# Altium schematic sheet Docking_Connection.SchDoc
size B; SheetNumber: 3; SheetTotal: 10
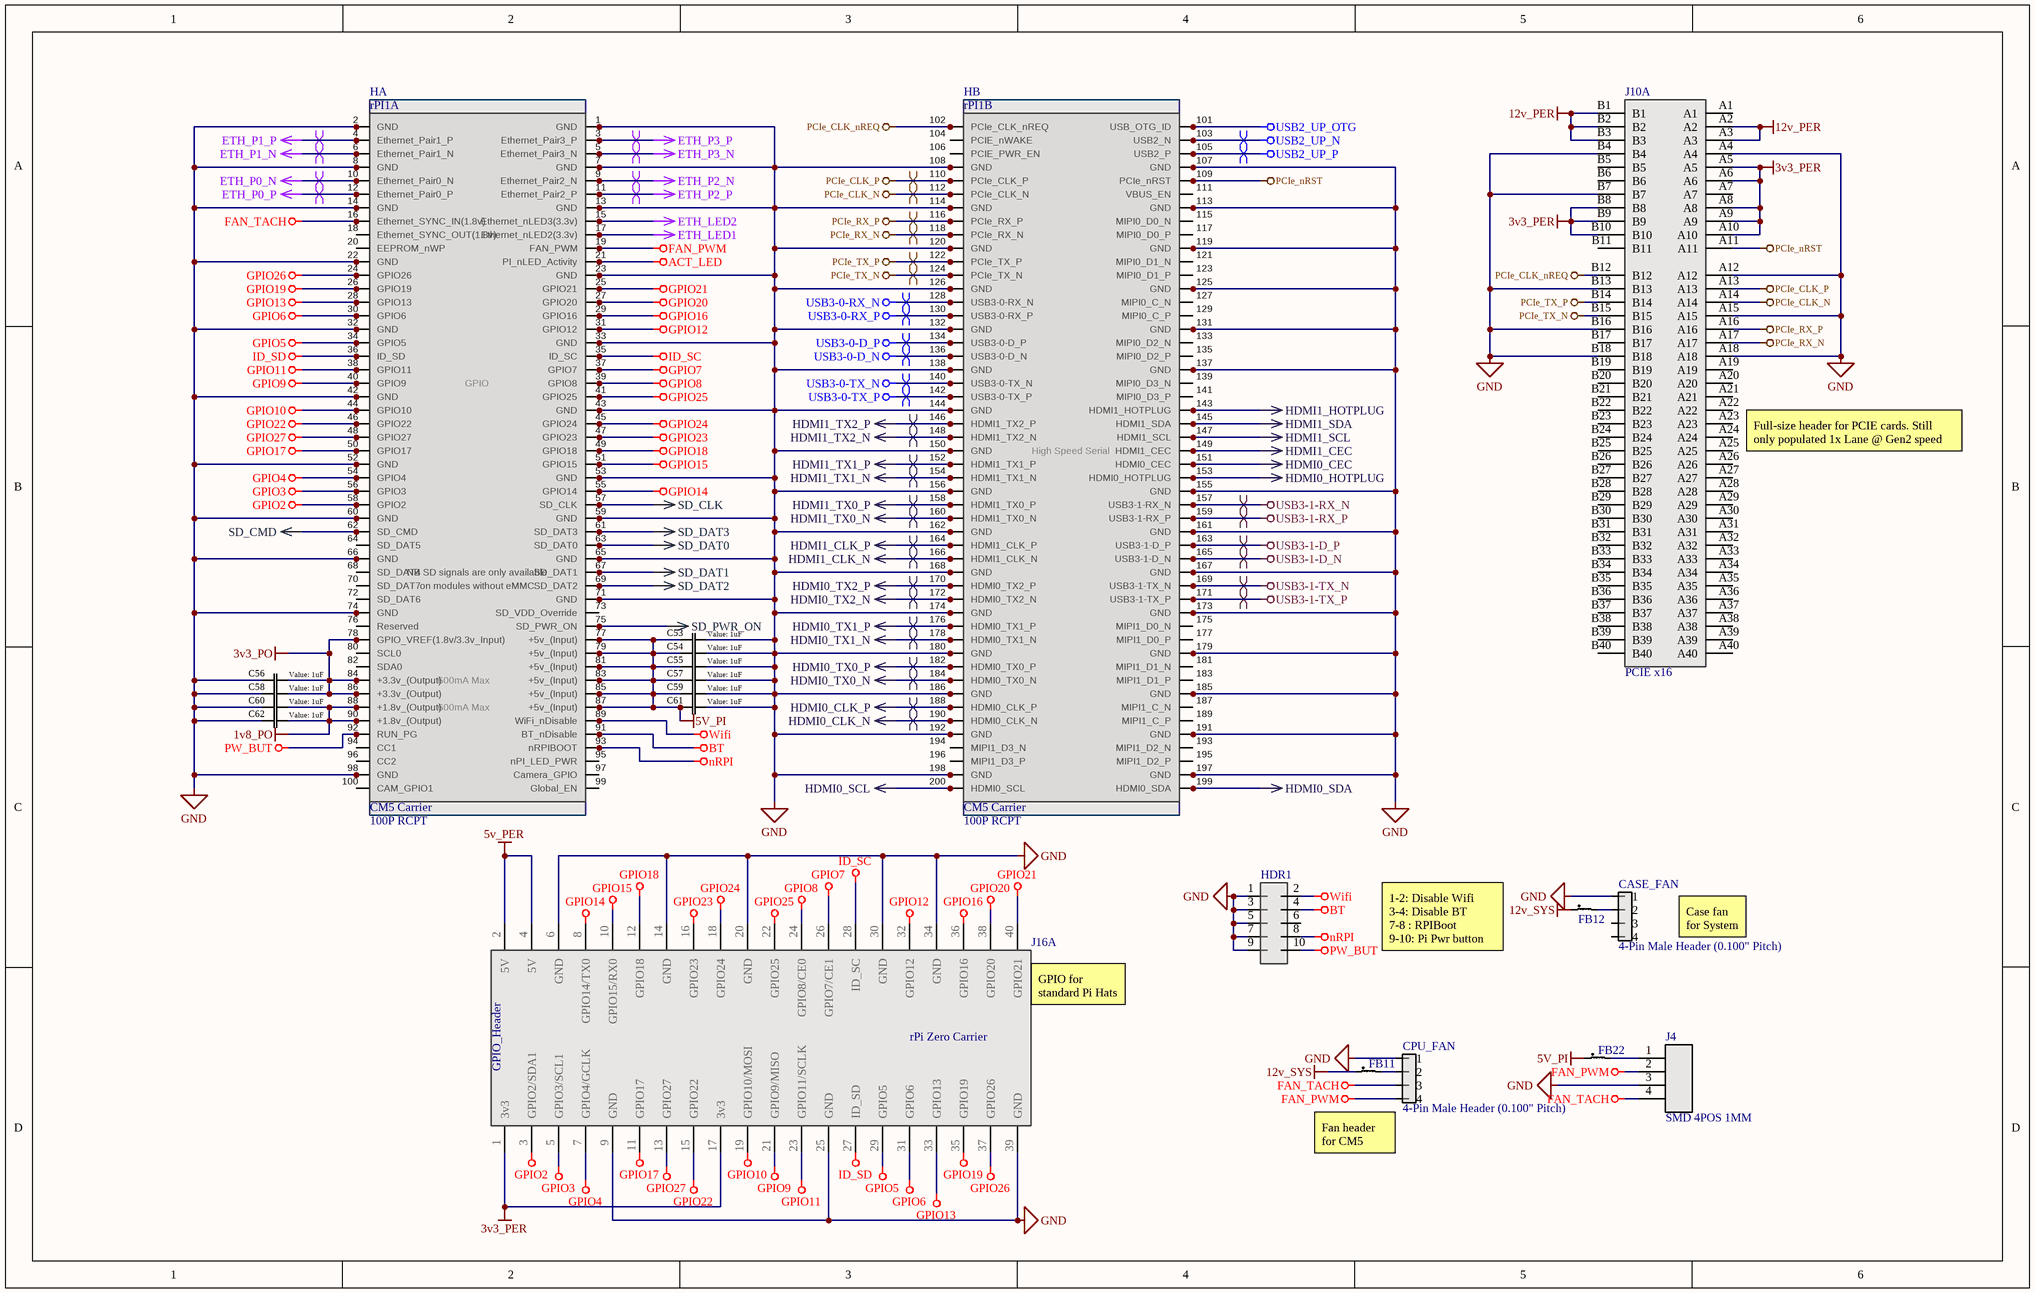
[diagram p0: Docking_Connection.SchDoc]

## Parts
C53  value 1uF  [0603]  (hidden comment: Generic Capacitor)
C54  value 1uF  [0603]  (hidden comment: Generic Capacitor)
C55  value 1uF  [0603]  (hidden comment: Generic Capacitor)
C56  value 1uF  [0603]  (hidden comment: Generic Capacitor)
C57  value 1uF  [0603]  (hidden comment: Generic Capacitor)
C58  value 1uF  [0603]  (hidden comment: Generic Capacitor)
C59  value 1uF  [0603]  (hidden comment: Generic Capacitor)
C60  value 1uF  [0603]  (hidden comment: Generic Capacitor)
C61  value 1uF  [0603]  (hidden comment: Generic Capacitor)
C62  value 1uF  [0603]  (hidden comment: Generic Capacitor)
CASE_FAN  4-Pin Male Header (0.100" Pitch)  [TSW-104-07-T-S]
CPU_FAN  4-Pin Male Header (0.100" Pitch)  [TSW-104-07-T-S]
FB11  0603 Ferrite  [0603]  (value not drawn)
FB12  0603 Ferrite  [0603]  (value not drawn)
FB22  0603 Ferrite  [0603]  (value not drawn)
HA  100P RCPT  [DF40HC(3.0)-100DS-0.4V(51)]
HB  100P RCPT  [DF40HC(3.0)-100DS-0.4V(51)]
HDR1  10pinMobo  [10pinMobo]  (value not drawn)
J4  SMD 4POS 1MM  [CONN4_BM04B-SRSS_JST]
J10  PCIE x16  [10018783-10203TLF]  (part A of 2)
J16  rPi Zero Carrier  [rPiZero]  (part A of 2)
rPI1  CM5 Carrier  [CM4-FTPD]  (parts A,B of 2)

## Nets
1v8_PO: C60.1 C62.1 HA.88 HA.90 rPI1.88(+1.8v_(Output)) rPI1.90(+1.8v_(Output))
3v3_PER: J10.A5 J10.A6 J10.A8 J10.A9 J10.A10 J10.B8 J10.B9 J10.B10 J16.1(3v3) J16.17(3v3)
3v3_PO: C56.1 C58.1 HA.78 HA.84 HA.86 rPI1.78(GPIO_VREF(1.8v/3.3v_Input)) rPI1.84(+3.3v_(Output)) rPI1.86(+3.3v_(Output))
5v_PER: J16.2(5V) J16.4(5V)
5V_PI: C53.2 C54.2 C55.2 C57.2 C59.2 C61.2 FB22.1 HA.77 HA.79 HA.81 HA.83 HA.85 HA.87 rPI1.77(+5v_(Input)) rPI1.79(+5v_(Input)) rPI1.81(+5v_(Input)) rPI1.83(+5v_(Input)) rPI1.85(+5v_(Input)) rPI1.87(+5v_(Input))
12v_PER: J10.A2 J10.A3 J10.B1 J10.B2 J10.B3
12v_SYS: FB11.1 FB12.1
ACT_LED: HA.21 rPI1.21(PI_nLED_Activity)
BT: HA.91 HDR1.4 rPI1.91(BT_nDisable)
ETH_LED1: HA.17 rPI1.17(Ethernet_nLED2(3.3v))
ETH_LED2: HA.15 rPI1.15(Ethernet_nLED3(3.3v))
ETH_P0_N: HA.10 rPI1.10(Ethernet_Pair0_N)
ETH_P0_P: HA.12 rPI1.12(Ethernet_Pair0_P)
ETH_P1_N: HA.6 rPI1.6(Ethernet_Pair1_N)
ETH_P1_P: HA.4 rPI1.4(Ethernet_Pair1_P)
ETH_P2_N: HA.9 rPI1.9(Ethernet_Pair2_N)
ETH_P2_P: HA.11 rPI1.11(Ethernet_Pair2_P)
ETH_P3_N: HA.5 rPI1.5(Ethernet_Pair3_N)
ETH_P3_P: HA.3 rPI1.3(Ethernet_Pair3_P)
FAN_PWM: CPU_FAN.4 HA.19 J4.2 rPI1.19(FAN_PWM)
FAN_TACH: CPU_FAN.3 HA.16 J4.4 rPI1.16(Ethernet_SYNC_IN(1.8v))
GND: C53.1 C54.1 C55.1 C56.2 C57.1 C58.2 C59.1 C60.2 C61.1 C62.2 CASE_FAN.1 CPU_FAN.1 HA.1 HA.2 HA.7 HA.8 HA.13 HA.14 HA.22 HA.23 HA.32 HA.33 HA.42 HA.43 HA.52 HA.53 HA.59 HA.60 HA.65 HA.66 HA.71 HA.74 HA.98 HB.7 HB.8 HB.13 HB.14 HB.19 HB.20 HB.25 HB.26 HB.31 HB.32 HB.37 HB.38 HB.44 HB.50 HB.55 HB.56 HB.61 HB.62 HB.67 HB.68 HB.73 HB.74 HB.79 HB.80 HB.85 HB.86 HB.91 HB.92 HB.97 HB.98 HDR1.1 HDR1.3 HDR1.5 HDR1.7 HDR1.9 J4.3 J10.A4 J10.A12 J10.A15 J10.A18 J10.B4 J10.B7 J10.B13 J10.B16 J10.B18 J16.6(GND) J16.9(GND) J16.14(GND) J16.20(GND) J16.25(GND) J16.30(GND) J16.34(GND) J16.39(GND) rPI1.1(GND) rPI1.2(GND) rPI1.7(GND) rPI1.8(GND) rPI1.13(GND) rPI1.14(GND) rPI1.22(GND) rPI1.23(GND) rPI1.32(GND) rPI1.33(GND) rPI1.42(GND) rPI1.43(GND) rPI1.52(GND) rPI1.53(GND) rPI1.59(GND) rPI1.60(GND) rPI1.65(GND) rPI1.66(GND) rPI1.71(GND) rPI1.74(GND) rPI1.98(GND) rPI1.107(GND) rPI1.108(GND) rPI1.113(GND) rPI1.114(GND) rPI1.119(GND) rPI1.120(GND) rPI1.125(GND) rPI1.126(GND) rPI1.131(GND) rPI1.132(GND) rPI1.137(GND) rPI1.138(GND) rPI1.144(GND) rPI1.150(GND) rPI1.155(GND) rPI1.156(GND) rPI1.161(GND) rPI1.162(GND) rPI1.167(GND) rPI1.168(GND) rPI1.173(GND) rPI1.174(GND) rPI1.179(GND) rPI1.180(GND) rPI1.185(GND) rPI1.186(GND) rPI1.191(GND) rPI1.192(GND) rPI1.197(GND) rPI1.198(GND)
GPIO2: HA.58 J16.3(GPIO2/SDA1) rPI1.58(GPIO2)
GPIO3: HA.56 J16.5(GPIO3/SCL1) rPI1.56(GPIO3)
GPIO4: HA.54 J16.7(GPIO4/GCLK) rPI1.54(GPIO4)
GPIO5: HA.34 J16.29(GPIO5) rPI1.34(GPIO5)
GPIO6: HA.30 J16.31(GPIO6) rPI1.30(GPIO6)
GPIO7: HA.37 J16.26(GPIO7/CE1) rPI1.37(GPIO7)
GPIO8: HA.39 J16.24(GPIO8/CE0) rPI1.39(GPIO8)
GPIO9: HA.40 J16.21(GPIO9/MISO) rPI1.40(GPIO9)
GPIO10: HA.44 J16.19(GPIO10/MOSI) rPI1.44(GPIO10)
GPIO11: HA.38 J16.23(GPIO11/SCLK) rPI1.38(GPIO11)
GPIO12: HA.31 J16.32(GPIO12) rPI1.31(GPIO12)
GPIO13: HA.28 J16.33(GPIO13) rPI1.28(GPIO13)
GPIO14: HA.55 J16.8(GPIO14/TX0) rPI1.55(GPIO14)
GPIO15: HA.51 J16.10(GPIO15/RX0) rPI1.51(GPIO15)
GPIO16: HA.29 J16.36(GPIO16) rPI1.29(GPIO16)
GPIO17: HA.50 J16.11(GPIO17) rPI1.50(GPIO17)
GPIO18: HA.49 J16.12(GPIO18) rPI1.49(GPIO18)
GPIO19: HA.26 J16.35(GPIO19) rPI1.26(GPIO19)
GPIO20: HA.27 J16.38(GPIO20) rPI1.27(GPIO20)
GPIO21: HA.25 J16.40(GPIO21) rPI1.25(GPIO21)
GPIO22: HA.46 J16.15(GPIO22) rPI1.46(GPIO22)
GPIO23: HA.47 J16.16(GPIO23) rPI1.47(GPIO23)
GPIO24: HA.45 J16.18(GPIO24) rPI1.45(GPIO24)
GPIO25: HA.41 J16.22(GPIO25) rPI1.41(GPIO25)
GPIO26: HA.24 J16.37(GPIO26) rPI1.24(GPIO26)
GPIO27: HA.48 J16.13(GPIO27) rPI1.48(GPIO27)
HDMI0_CEC: HB.51 rPI1.151(HDMI0_CEC)
HDMI0_CLK_N: HB.90 rPI1.190(HDMI0_CLK_N)
HDMI0_CLK_P: HB.88 rPI1.188(HDMI0_CLK_P)
HDMI0_HOTPLUG: HB.53 rPI1.153(HDMI0_HOTPLUG)
HDMI0_SCL: HB.100 rPI1.200(HDMI0_SCL)
HDMI0_SDA: HB.99 rPI1.199(HDMI0_SDA)
HDMI0_TX0_N: HB.84 rPI1.184(HDMI0_TX0_N)
HDMI0_TX0_P: HB.82 rPI1.182(HDMI0_TX0_P)
HDMI0_TX1_N: HB.78 rPI1.178(HDMI0_TX1_N)
HDMI0_TX1_P: HB.76 rPI1.176(HDMI0_TX1_P)
HDMI0_TX2_N: HB.72 rPI1.172(HDMI0_TX2_N)
HDMI0_TX2_P: HB.70 rPI1.170(HDMI0_TX2_P)
HDMI1_CEC: HB.49 rPI1.149(HDMI1_CEC)
HDMI1_CLK_N: HB.66 rPI1.166(HDMI1_CLK_N)
HDMI1_CLK_P: HB.64 rPI1.164(HDMI1_CLK_P)
HDMI1_HOTPLUG: HB.43 rPI1.143(HDMI1_HOTPLUG)
HDMI1_SCL: HB.47 rPI1.147(HDMI1_SCL)
HDMI1_SDA: HB.45 rPI1.145(HDMI1_SDA)
HDMI1_TX0_N: HB.60 rPI1.160(HDMI1_TX0_N)
HDMI1_TX0_P: HB.58 rPI1.158(HDMI1_TX0_P)
HDMI1_TX1_N: HB.54 rPI1.154(HDMI1_TX1_N)
HDMI1_TX1_P: HB.52 rPI1.152(HDMI1_TX1_P)
HDMI1_TX2_N: HB.48 rPI1.148(HDMI1_TX2_N)
HDMI1_TX2_P: HB.46 rPI1.146(HDMI1_TX2_P)
ID_SC: HA.35 J16.28(ID_SC) rPI1.35(ID_SC)
ID_SD: HA.36 J16.27(ID_SD) rPI1.36(ID_SD)
nRPI: HA.93 HDR1.8 rPI1.93(nRPIBOOT)
PCIe_CLK_N: HB.12 J10.A14 rPI1.112(PCIe_CLK_N)
PCIe_CLK_nREQ: HB.2 J10.B12 rPI1.102(PCIe_CLK_nREQ)
PCIe_CLK_P: HB.10 J10.A13 rPI1.110(PCIe_CLK_P)
PCIe_nRST: HB.9 J10.A11 rPI1.109(PCIe_nRST)
PCIe_RX_N: HB.18 J10.A17 rPI1.118(PCIe_RX_N)
PCIe_RX_P: HB.16 J10.A16 rPI1.116(PCIe_RX_P)
PCIe_TX_N: HB.24 J10.B15 rPI1.124(PCIe_TX_N)
PCIe_TX_P: HB.22 J10.B14 rPI1.122(PCIe_TX_P)
PW_BUT: HA.92 HDR1.10 rPI1.92(RUN_PG)
SD_CLK: HA.57 rPI1.57(SD_CLK)
SD_CMD: HA.62 rPI1.62(SD_CMD)
SD_DAT0: HA.63 rPI1.63(SD_DAT0)
SD_DAT1: HA.67 rPI1.67(SD_DAT1)
SD_DAT2: HA.69 rPI1.69(SD_DAT2)
SD_DAT3: HA.61 rPI1.61(SD_DAT3)
SD_PWR_ON: HA.75 rPI1.75(SD_PWR_ON)
USB2_UP_N: HB.3 rPI1.103(USB2_N)
USB2_UP_OTG: HB.1 rPI1.101(USB_OTG_ID)
USB2_UP_P: HB.5 rPI1.105(USB2_P)
USB3-0-D_N: HB.36 rPI1.136(USB3-0-D_N)
USB3-0-D_P: HB.34 rPI1.134(USB3-0-D_P)
USB3-0-RX_N: HB.28 rPI1.128(USB3-0-RX_N)
USB3-0-RX_P: HB.30 rPI1.130(USB3-0-RX_P)
USB3-0-TX_N: HB.40 rPI1.140(USB3-0-TX_N)
USB3-0-TX_P: HB.42 rPI1.142(USB3-0-TX_P)
USB3-1-D_N: HB.65 rPI1.165(USB3-1-D_N)
USB3-1-D_P: HB.63 rPI1.163(USB3-1-D_P)
USB3-1-RX_N: HB.57 rPI1.157(USB3-1-RX_N)
USB3-1-RX_P: HB.59 rPI1.159(USB3-1-RX_P)
USB3-1-TX_N: HB.69 rPI1.169(USB3-1-TX_N)
USB3-1-TX_P: HB.71 rPI1.171(USB3-1-TX_P)
Wifi: HA.89 HDR1.2 rPI1.89(WiFi_nDisable)
NetCASE_FAN_2: CASE_FAN.2 FB12.2
NetCPU_FAN_2: CPU_FAN.2 FB11.2
NetFB22_2: FB22.2 J4.1
NetHA_18: HA.18 rPI1.18(Ethernet_SYNC_OUT(1.8v))
NetHA_20: HA.20 rPI1.20(EEPROM_nWP)
NetHA_64: HA.64 rPI1.64(SD_DAT5)
NetHA_68: HA.68 rPI1.68(SD_DAT4)
NetHA_70: HA.70 rPI1.70(SD_DAT7)
NetHA_72: HA.72 rPI1.72(SD_DAT6)
NetHA_73: HA.73 rPI1.73(SD_VDD_Override)
NetHA_76: HA.76 rPI1.76(Reserved)
NetHA_80: HA.80 rPI1.80(SCL0)
NetHA_82: HA.82 rPI1.82(SDA0)
NetHA_94: HA.94 rPI1.94(CC1)
NetHA_95: HA.95 rPI1.95(nPI_LED_PWR)
NetHA_96: HA.96 rPI1.96(CC2)
NetHA_97: HA.97 rPI1.97(Camera_GPIO)
NetHA_99: HA.99 rPI1.99(Global_EN)
NetHA_100: HA.100 rPI1.100(CAM_GPIO1)
NetHB_4: HB.4 rPI1.104(PCIE_nWAKE)
NetHB_6: HB.6 rPI1.106(PCIE_PWR_EN)
NetHB_11: HB.11 rPI1.111(VBUS_EN)
NetHB_15: HB.15 rPI1.115(MIPI0_D0_N)
NetHB_17: HB.17 rPI1.117(MIPI0_D0_P)
NetHB_21: HB.21 rPI1.121(MIPI0_D1_N)
NetHB_23: HB.23 rPI1.123(MIPI0_D1_P)
NetHB_27: HB.27 rPI1.127(MIPI0_C_N)
NetHB_29: HB.29 rPI1.129(MIPI0_C_P)
NetHB_33: HB.33 rPI1.133(MIPI0_D2_N)
NetHB_35: HB.35 rPI1.135(MIPI0_D2_P)
NetHB_39: HB.39 rPI1.139(MIPI0_D3_N)
NetHB_41: HB.41 rPI1.141(MIPI0_D3_P)
NetHB_75: HB.75 rPI1.175(MIPI1_D0_N)
NetHB_77: HB.77 rPI1.177(MIPI1_D0_P)
NetHB_81: HB.81 rPI1.181(MIPI1_D1_N)
NetHB_83: HB.83 rPI1.183(MIPI1_D1_P)
NetHB_87: HB.87 rPI1.187(MIPI1_C_N)
NetHB_89: HB.89 rPI1.189(MIPI1_C_P)
NetHB_93: HB.93 rPI1.193(MIPI1_D2_N)
NetHB_94: HB.94 rPI1.194(MIPI1_D3_N)
NetHB_95: HB.95 rPI1.195(MIPI1_D2_P)
NetHB_96: HB.96 rPI1.196(MIPI1_D3_P)

Not connected (* = marked no-connect by the designer): CASE_FAN 3 4; HDR1 6; J10 A1 A7 A19 A20 A21 A22 A23 A24 A25 A26 A27 A28 A29 A30 A31 A32 A33 A34 A35 A36 A37 A38 A39 A40 B5 B6 B11 B17 B19 B20 B21 B22 B23 B24 B25 B26 B27 B28 B29 B30 B31 B32 B33 B34 B35 B36 B37 B38 B39 B40

## Layout directives
differential pair: ETH_P0_N, ETH_P0_P, ETH_P1_N, ETH_P1_P, ETH_P2_N, ETH_P2_P, ETH_P3_N, ETH_P3_P, HDMI0_CLK_N, HDMI0_CLK_P, HDMI0_TX0_N, HDMI0_TX0_P, HDMI0_TX1_N, HDMI0_TX1_P, HDMI0_TX2_N, HDMI0_TX2_P, HDMI1_CLK_N, HDMI1_CLK_P, HDMI1_TX0_N, HDMI1_TX0_P, HDMI1_TX1_N, HDMI1_TX1_P, HDMI1_TX2_N, HDMI1_TX2_P, PCIe_CLK_N, PCIe_CLK_P, PCIe_RX_N, PCIe_RX_P, PCIe_TX_N, PCIe_TX_P, USB2_UP_N, USB2_UP_P, USB3-0-D_N, USB3-0-D_P, USB3-0-RX_N, USB3-0-RX_P, USB3-0-TX_N, USB3-0-TX_P, USB3-1-D_N, USB3-1-D_P, USB3-1-RX_N, USB3-1-RX_P, USB3-1-TX_N, USB3-1-TX_P

## Notes on the sheet
- (near J10) Full-size header for PCIE cards. Still only populated 1x Lane @ Gen2 speed
- 1-2: Disable Wifi
  3-4: Disable BT
  7-8 : RPIBoot
  9-10: Pi Pwr button
- Case fan for System
- (near J16) GPIO for standard Pi Hats
- (near CPU_FAN) Fan header for CM5
- REV
- REVISIONS
- DATE
- DESCRIPTION
- BY
- UNLESS OTHERWISE SPECIFIED, DRAWING DEFINITIONS AND TOLERANCES SHALL BE FOUND UNDER SUPPLIER STANDARDS SS-001. THIS PART AND ALL COMPONENTS OF IT MUST BE RoHS & REACH COMPLIANT. A CERTIFICATE OF COMPLIANCE MUST BE PROVIDED UPON REQUEST.
- ALL INFORMATION ON THIS DOCUMENT IS THE SOLE PROPERTY OF GAMBER-JOHNSON AND SHALL NOT BE COPIED, REPRODUCED, USED OR DISCLOSED IN WHOLE OR IN PART WITHOUT THE WRITTEN CONSENT OF GAMBER-JOHNSON
- TOLERANCES
  .00 ± .060
  .000 ± .020
  .0000 ± .005
  ANGELS ± 1°
- DRAWN BY:
- PROJECT NUMBER:
- SHEET TITLE:
- SHEET
- OF
- DATE:
- LOCATION:
- ASSEMBLY NUMBER
- SIZE
- GAMBER-JOHNSON LLC
  5001 JOERNS DR.
  STEVENS POINT, WI 54481
  +1 (715) 344-5209
- B
- (in symbol RP-CM5, part A) GPIO; NB SD signals are only available; on modules without eMMC; 600mA Max
- (in symbol RP-CM5, part B) High Speed Serial
- (in symbol RP-Zero, part A) GPIO_Header

## Library data of the parts
C53-C62 = Generic Capacitor: Voltage: 6V; Tolerance: 5%
CASE_FAN CPU_FAN = TSW-104-07-T-S: Connector Header Through Hole 4 position 0.100" (2.54mm); Manufacturer 1: Samtec; Manufacturer Part Number 1: MTSW-104-07-T-S-170; Number of Contacts: 4; Supplier 1: Avnet; RoHS: Yes; Category: Connectors; Mount: Through Hole; Contact Plating: Tin; Contact Material: Bronze; Min Operating Temperature: -55°C; Max Operating Temperature: 105°C; Number of Rows: 1; Termination: Solder; Gender: Male; Packaging: Bulk; Orientation: Vertical; Pitch: 2.54mm; Radiation Hardening: No; RoHS Compliant: Yes; Lead Free: Lead Free; ComponentLink1URL: http://www.samtec.com/documents/webfiles/pdf/HMTSW.PDF?src-supplier=Avnet; ComponentLink1Description: http://www.samtec.com/documents/webfiles/pdf/HMTSW.PDF?src-supplier=Avnet; Supplier Part Number 1: MTSW-104-07-T-S-170
FB11 FB12 FB22 = PE-0603FB121ST: 120 Ohms @ 100 MHz 1 Signal Line Ferrite Bead 0603 (1608 Metric) 500mA 180mOhm; Manufacturer: Pulse; Number of Lines: 1; DC Resistance (DCR): 180mR; Supplier 1: Digi-Key; Supplier Part Number 1: 553-2382-1-ND; Manufacturer Part Number: PE-0603FB121ST; RoHS: Yes; Category: Inductors; Stock 1: 6181; Pricing 1: 1=0.10000, 10=0.04400, 25=0.03920, 50=0.03580, 100=0.03220, 250=0.02360, 500=0.01716, 1000=0.01680 (USD); Mount: Surface Mount; Case/Package: 0603; Case Code (Metric): 1608; Case Code (Imperial): 0603; Min Operating Temperature: -40°C; Max Operating Temperature: 105°C; Package Quantity: 4000; Packaging: Tape and Reel; Max Current Rating: 500mA; Length: 0.063inch; Width: 0.031inch; Height: 0.037inch; RoHS Compliant: Yes; ComponentLink1URL: https://productfinder.pulseeng.com/doc_type/WEB301/doc_num/WC706/doc_part/WC706.pdf?src-supplier=Digi-Key; ComponentLink1Description: https://productfinder.pulseeng.com/doc_type/WEB301/doc_num/WC706/doc_part/WC706.pdf?src-supplier=Digi-Key; ComponentLink2URL: http://productfinder.pulseeng.com/products/datasheets/WC706.pdf?src-supplier=Digi-Key; ComponentLink2Description: http://productfinder.pulseeng.com/products/datasheets/WC706.pdf?src-supplier=Digi-Key; LCSC PN: C275486
HA HB = DF40-100DS RCPT_1: 100 Position Connector Receptacle, Center Strip Contacts Surface Mount Gold; MF: Hirose; MP: DF40C-100DS-0.4V(51); SnapEDA_Link: https://www.snapeda.com/parts/DF40C-100DS-0.4V(51)/Hirose/view-part/?ref=snap; Package: None; Value: *; Check_prices: https://www.snapeda.com/parts/DF40C-100DS-0.4V(51)/Hirose/view-part/?ref=eda; LCSC PN: C424649; Supplier 1: Avnet; Supplier Part Number 1: DF40C-100DS-0.4V(5; Supplier 2: Digikey; Supplier Part Number 2: 26-DF40HC(3.0)-100DS-0.4V(51)CT-ND
HDR1 = 10pinMobo: 10pin motherboard jack
J4 = BM04B-SRSS-TB: Connector Header Surface Mount 4 position 0.039" (1.00mm); Mfr_Name: JST; Type: Headers, Male Pins; RefDes: RefDes
J10 = 10018783-10203TLF: 164 Position Female Connector PCI Express™ Gold 0.039" (1.00mm) Black; MF: Amphenol ICC; Package: None; Price: None; Value: *; MP: 10018783-10203TLF; Availability: Unavailable; LCSC PN: C426228; Supplier 1: Avnet; Supplier Part Number 1: 73P6874
J16 = RP-Zero: Raspberry Pi Zero/W/2W / Header, debug-pads, & mounting
rPI1 = RP-CM5: Compute Module 5 Footprint / Overlap Hirose 100P connector over pads to place actual components